# EAGLE design mp28164-buck-boost-flashlight-driver-tester-mk-1.0.0 (EAGLE 9.2.2)
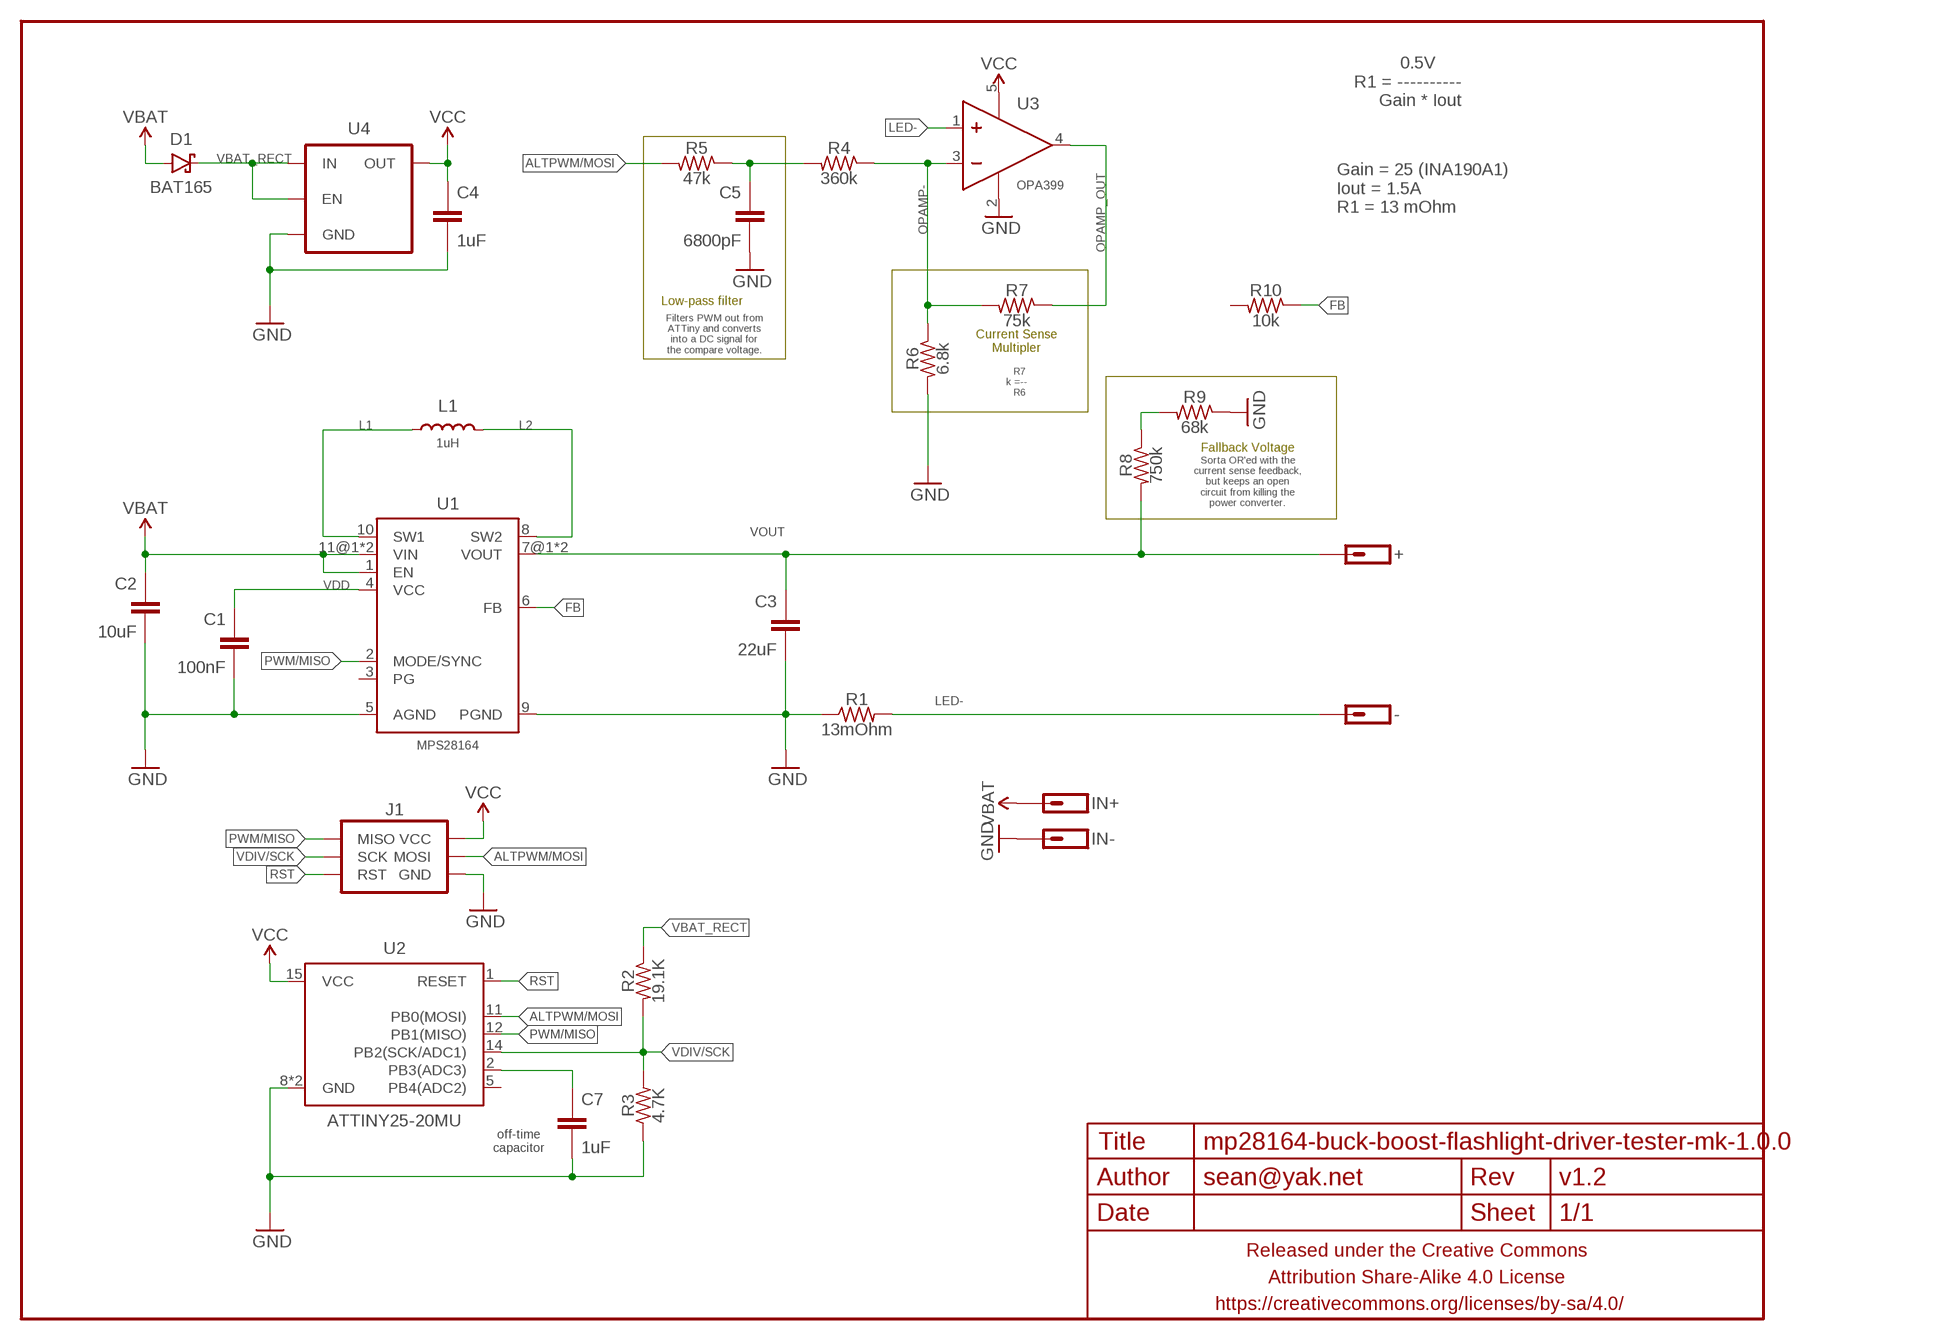
[diagram p0: schematic, sheet 1]

## Parts
+  M01PTH-1MM-CIR-NS  [1X01-1MM-CIR-NS]
-  M01PTH-1MM-CIR-NS  [1X01-1MM-CIR-NS]
C1  100nF  CAPACITOR-CERAMICC0402  [C0402]
C2  10uF  CAPACITOR-CERAMICC0805-TIGHTER  [C0805-TIGHTER]
C3  22uF  CAPACITOR-CERAMICC0805-TIGHTER  [C0805-TIGHTER]
C4  1uF  CAPACITOR-CERAMICC0402  [C0402]
C5  6800pF  CAPACITOR-CERAMICC0402  [C0402]
C7  1uF  CAPACITOR-CERAMICC0402  [C0402]
D1  BAT165  DIODE-SCHOTTKYSOD323  [SOD323-SCHOTTKY]
FRAME1  FRAME-LETTERNO_PACKAGE  [DUMMY]
IN+  M01PTH-1MM-CIR-NS  [1X01-1MM-CIR-NS]
IN-  M01PTH-1MM-CIR-NS  [1X01-1MM-CIR-NS]
J1  AVR_SPI_PRG_6SMD-1.27MM  [2X3-1.27MM-SMD]
L1  1uH  INDUCTORXAR7030  [XAR7030]
R1  13mOhm  RESISTORR0805-TIGHTER  [R0805-TIGHTER]
R2  19.1K  RESISTORR0402  [R0402]
R3  4.7K  RESISTORR0402  [R0402]
R4  360k  RESISTORR0402  [R0402]
R5  47k  RESISTORR0402  [R0402]
R6  6.8k  RESISTORR0402  [R0402]
R7  75k  RESISTORR0402  [R0402]
R8  750k  RESISTORR0402  [R0402]
R9  68k  RESISTORR0402  [R0402]
R10  10k  RESISTORR0402  [R0402]
U1  MPS28164  [MPS28164]
U2  ATTINY25-20MU  ATTINY45TINY85-20-QFN  [QFN20]
U3  OPA399  OPAMPOPA333-SC-70  [SC70]
U4  V_REG_ENTLV700  [SC70]

## Nets
ALTPWM/MOSI: J1.4(MOSI) R5.2 U2.11(PB0(MOSI))
FB: R10.1 U1.6(FB)
GND: C1.2 C2.2 C3.2 C4.2 C5.2 C7.2 IN-.1 J1.6(GND) R1.1 R3.1 R6.2 R9.1 U1.5(AGND) U1.9(PGND) U2.8(GND) U2.PAD(GND) U3.2(V-) U4.2(GND)
L1: L1.P$1 U1.10(SW1)
L2: L1.P$2 U1.8(SW2)
LED-: -.1 R1.2 U3.1(IN+)
N$1: C5.1 R4.2 R5.1
N$2: R8.1 R9.2
N$5: C7.1 U2.2(PB3(ADC3))
OPAMP-: R4.1 R6.1 R7.2 U3.3(IN-)
OPAMP_OUT: R7.1 U3.4(OUT)
PWM/MISO: J1.1(MISO) U1.2(MODE/SYNC) U2.12(PB1(MISO))
RST: J1.5(RST) U2.1(RESET)
VBAT: C2.1 D1.A IN+.1 U1.1(EN) U1.11@1(VIN) U1.11@2(VIN)
VBAT_RECT: D1.C R2.1 U4.1(IN) U4.3(EN)
VCC: C4.1 J1.2(VCC) U2.15(VCC) U3.5(V+) U4.5(OUT)
VDD: C1.1 U1.4(VCC)
VDIV/SCK: J1.3(SCK) R2.2 R3.2 U2.14(PB2(SCK/ADC1))
VOUT: +.1 C3.1 R8.2 U1.7@1(VOUT) U1.7@2(VOUT)
Unconnected: R10.2 U1.3(PG) U2.5(PB4(ADC2))

## Notes on the sheet
- 0.5V
  R1 = ----------
       Gain * Iout
- Gain = 25 (INA190A1)
  Iout = 1.5A
  R1 = 13 mOhm
- Low-pass filter
- Filters PWM out from
  ATTiny and converts
  into a DC signal for
  the compare voltage.
- Current Sense
  Multipler
- R7
  k =--
    R6
- Fallback Voltage
- Sorta OR'ed with the
  current sense feedback,
  but keeps an open
  circuit from killing the
  power converter.
- off-time
  capacitor

## Library data of the parts
+ - IN+ IN- = a_parts:M01: Header 1 Standard 1-pin 0.1" header. Use with straight break away headers (SKU : PRT-00116), right angle break away headers (PRT-00553), swiss pins (PRT-00743), machine pins (PRT-00117), and female headers (PRT-00115).
C1-C5 C7 = a_parts:CAPACITOR-CERAMIC: CAPACITOR, European symbol
D1 = a_parts:DIODE-SCHOTTKY: Schottky diodes in SFE's production catalog BAT20J 1A 23V 0.62Vf RB751 120mA 40V 0.37Vf PMEG4005EJ 0.5A 40V 0.42Vf MBRA140 1A 40V 0.5Vf B340A 3A 40V SMA
FRAME1 = a_parts:FRAME-LETTER: Schematic Frame Standard 8.5x11 US Letter frame; DESIGNER: sean@yak.net; VERSION: v1.2
J1 = a_parts:AVR_SPI_PRG_6: AVR ISP 6 Pin This is the reduced ISP connector for AVR programming. Common on Arduino. This footprint will take up less PCB space and can be used with a 10-pin to 6-pin adapter such as SKU: BOB-08508 **Special note about "TEST_POINT" package. The stop mask is on the top side, so if you want your programming test points to be on the bottom of your board, make sure to place this package on the bottom side of the board. This also ensure that the orientation to program from the bottom side will be correct.
L1 = a_parts:INDUCTOR: Inductors Basic Inductor/Choke - 0603 and 1206. Footprints are not proven and vary greatly between part numbers. SRN6045- 33uH, 20% 1.4A SDR0403-560KL - 56uH, 10%, 500mA RMS/740mA peak
R1-R10 = a_parts:RESISTOR: RESISTOR, American symbol
U1 = a_parts:MPS28164
U2 = a_parts:ATTINY45: Atmel 8-pin 2/4/8kB flash uC
U3 = a_parts:OPAMP
U4 = a_parts:V_REG_EN

## Board
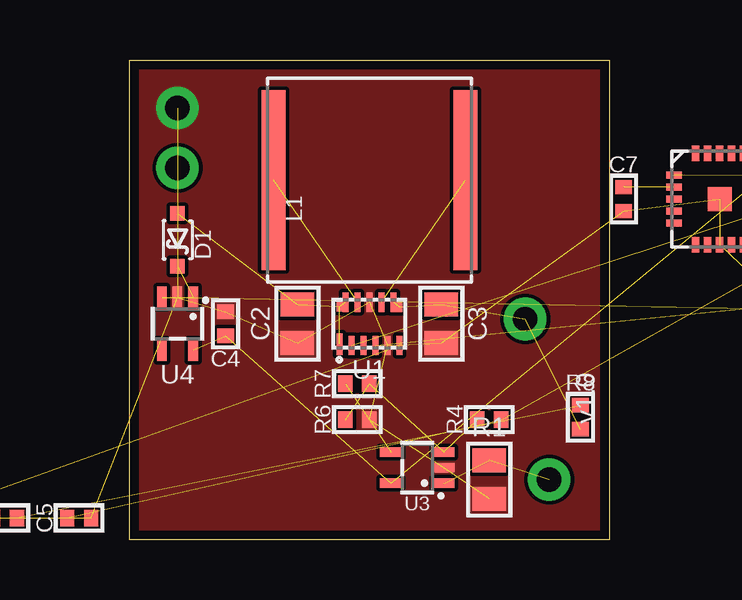
[diagram p1: board, top side]
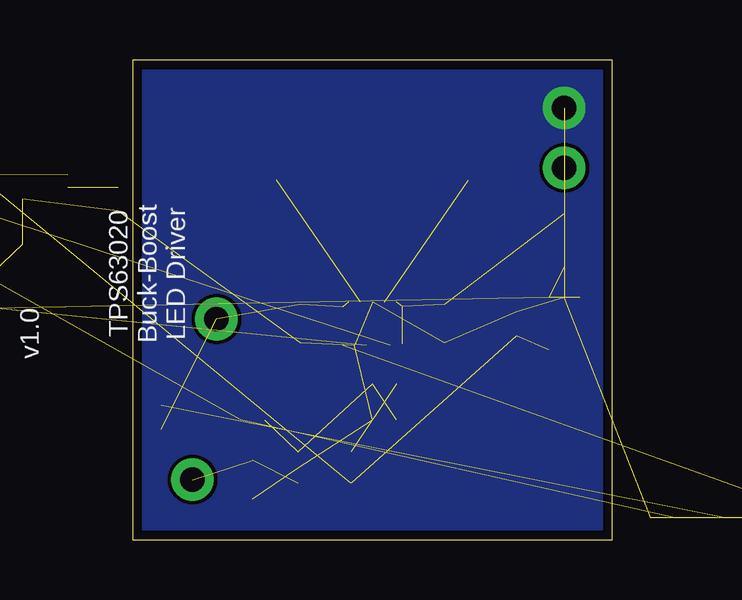
[diagram p2: board, bottom side, seen from below]

Size 20 x 20 mm. Coordinates in mm from the lower left corner, seen from the top.
Outline: 0,20 20,20 20,0 0,0 0,20
Copper layers (1*16): Top 0.035559375mm / dielectric 1.6mm / Bottom 0.035559375mm
Design rules "oshpark-2layer": minimum track width 6mil, minimum drill 10mil, track to track 6mil, track to pad 6mil, pad to pad 6mil, via to via 6mil, smd to smd 0mil, copper to edge 15mil, drill to drill 6mil, minimum pad ring 5mil, minimum via ring 5mil, stop-mask expansion 2.5mil, vias tented up to drill 20mil, thermal gap 10mil

### Footprints (pad centres in the part's own frame; a part is rotated, then mirrored left to right if it is on the bottom)
1X01-1MM-CIR-NS = drill 1.016 pad 1.778: 1 0,0
C0402 = smd 0.6 x 0.7: 1 -0.5,0; 2 0.5,0
C0805-TIGHTER = smd 1 x 1.4: 1 -0.8,0; 2 0.8,0
SOD323-SCHOTTKY = smd 0.6 x 0.6: A -1.1,0; C 1.1,0
2X3-1.27MM-SMD = smd 1.016 x 1.016: 1 -1.27,-0.635; 2 -1.27,0.635; 3 0,-0.635; 4 0,0.635; 5 1.27,-0.635; 6 1.27,0.635
XAR7030 = smd 1 x 7.5: P$1 -4,0; P$2 4,0
R0805-TIGHTER = smd 1 x 1.4: 1 -0.8,0; 2 0.8,0
R0402 = smd 0.6 x 0.7: 1 -0.5,0; 2 0.5,0
MPS28164 = smd 0.9 x 0.25: 1 -0.85,1.25 | smd 0.8 x 0.25: 2 -0.9,0.75; 3 -0.9,0.25; 4 -0.9,-0.25; 5 -0.9,-0.75; 6 -0.9,-1.25; 7@1 0.9,-1; 8 0.9,-0.5; 9 0.9,0; 10 0.9,0.5; 11@1 0.9,1 | smd 0.4 x 0.25: 7@2 0.7,-1.25; 11@2 0.71,1.25
QFN20 = smd 0.65 x 0.3: 1 -1.9,1; 2 -1.9,0.5; 3 -1.9,0; 4 -1.9,-0.5; 5 -1.9,-1; 11 1.9,-1; 12 1.9,-0.5; 13 1.9,0; 14 1.9,0.5; 15 1.9,1 | smd 0.3 x 0.65: 6 -1,-1.9; 7 -0.5,-1.9; 8 0,-1.9; 9 0.5,-1.9; 10 1,-1.9; 16 1,1.9; 17 0.5,1.9; 18 0,1.9; 19 -0.5,1.9; 20 -1,1.9 | smd 1 x 1: PAD 0,0
SC70 = smd 0.4 x 0.9: 1 -0.65,-1.1; 2 0,-1.1; 3 0.65,-1.1; 4 0.65,1.1; 5 -0.65,1.1

### Placement (x,y rotation side)
+  16.5,9.2 0 top
-  17.5,2.5 270 top
C1  26.3,10.2 90 bottom  (outside the outline)
C2  7,9 270 top
C3  13,9 270 top
C4  4,9 90 top
C5  -2.1,0.9 0 top
C7  20.6,14.2 270 top
D1  2,12.5 270 top
FRAME1  0,0 0 top
IN+  2,15.5 0 top
IN-  2,18 0 top
J1  30,15.9 0 top  (outside the outline)
L1  10,15 0 top
R1  15,2.5 90 top
R2  28.6,9.6 0 top  (outside the outline)
R3  28.6,11.1 0 top  (outside the outline)
R4  15,5 0 top
R5  29.4,13.1 180 top  (outside the outline)
R6  9.5,5 0 top
R7  9.5,6.5 0 top
R8  18.8,5.1 270 top
R9  -5.2,0.9 0 top  (outside the outline)
R10  -8.3,0.9 0 top  (outside the outline)
U1  10,9 90 top
U2  24.6,14.2 0 top
U3  12,3 90 top
U4  2,9 180 top

### Tracks (layer width: path | path; a pad name or v marks a point on that pad's centre or on a via)
ALTPWM/MOSI  (2 unrouted)
FB  (1 unrouted)
GND  (17 unrouted)
  pour Top (rank 2, no thermals): 0,0 20,0 20,20 0,20
  pour Bottom (rank 2, no thermals): 20,0 0,0 0,20 20,20
L1  (1 unrouted)
L2  (1 unrouted)
LED-  (2 unrouted)
N$1  (2 unrouted)
N$2  (1 unrouted)
N$5  (1 unrouted)
OPAMP-  (3 unrouted)
OPAMP_OUT  (1 unrouted)
PWM/MISO  (2 unrouted)
RST  (1 unrouted)
VBAT  (5 unrouted)
VBAT_RECT  (3 unrouted)
VCC  (4 unrouted)
VDD  (1 unrouted)
VDIV/SCK  (3 unrouted)
VOUT  (4 unrouted)

### Text on the board
bPlace: TPS63020 / Buck-Boost / LED Driver